# Altium project Augmented_Reality_Sandbox.PrjPcb
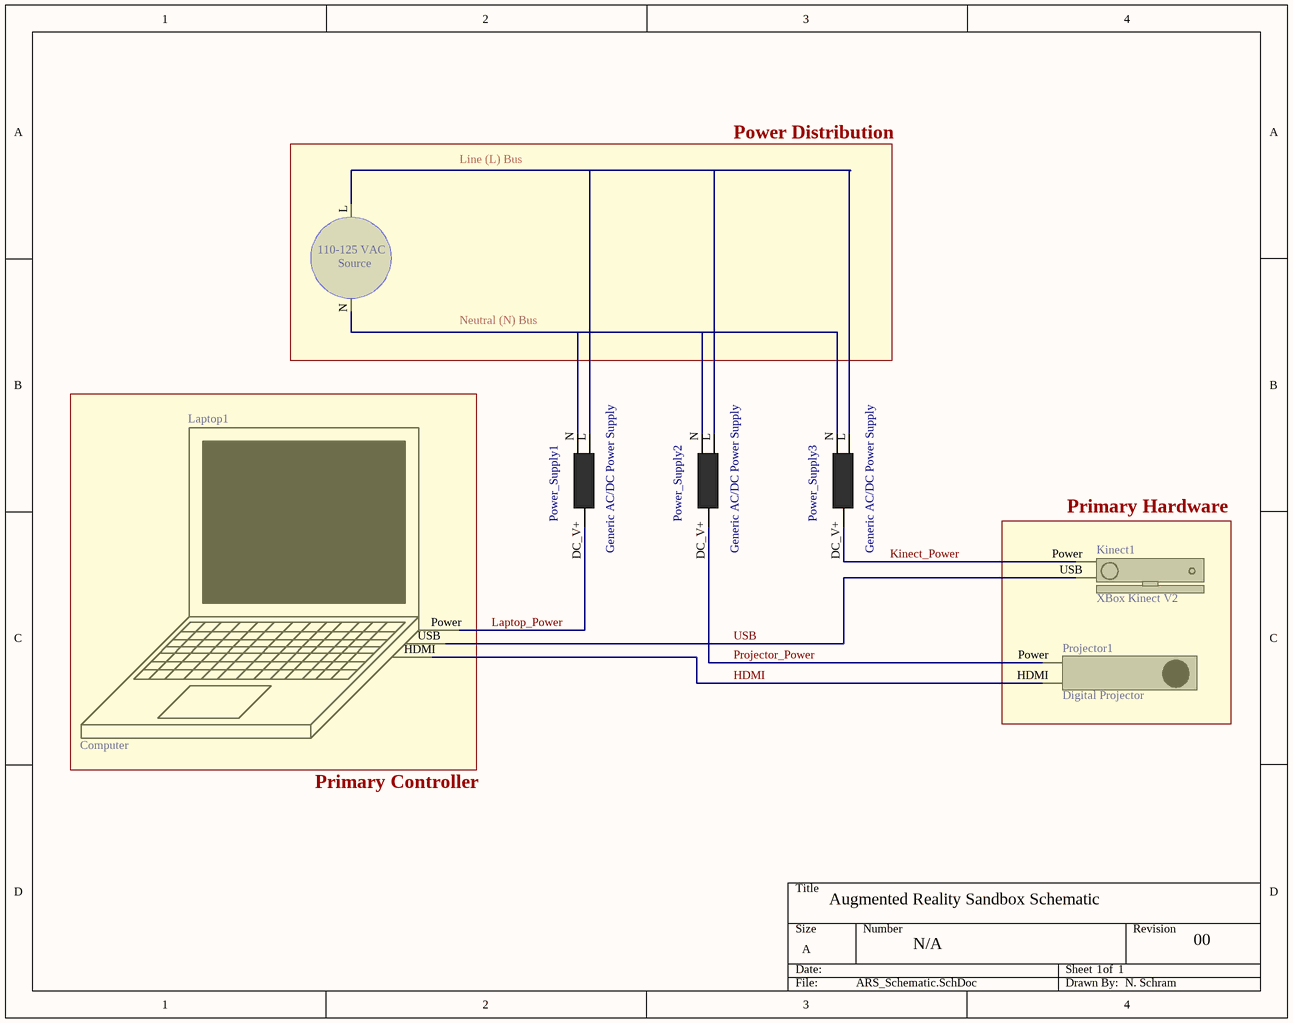
[diagram p0: ARS_Schematic.SchDoc]
1 sheet, 7 parts. Net scope: global (net labels, ports and power ports of the same name join across sheets).

## Sheet ARS_Schematic.SchDoc
size A

### Parts
AC1  110-125 VAC  (value not drawn)
Kinect1  XBox Kinect V2
Laptop1  Computer
Power_Supply1  Generic AC/DC Power Supply
Power_Supply2  Generic AC/DC Power Supply
Power_Supply3  Generic AC/DC Power Supply
Projector1  Digital Projector

### Blocks framed on the sheet
Power Distribution: AC1
Primary Hardware: Kinect1 Projector1

### Nets
HDMI: Laptop1.HDMI Projector1.HDMI
Kinect_Power: Kinect1.Power Power_Supply3.DC_V+
Laptop_Power: Laptop1.Power Power_Supply1.DC_V+
Projector_Power: Power_Supply2.DC_V+ Projector1.Power
USB: Kinect1.USB Laptop1.USB

Not connected (* = marked no-connect by the designer): AC1 L N; Power_Supply1 L N; Power_Supply2 L N; Power_Supply3 L N

### Notes on the sheet
- Primary Controller
- Augmented Reality Sandbox Schematic
- N/A
- 1
- 00
- N. Schram
- Labels drawn without touching a wire or pin: Line (L) Bus, Neutral (N) Bus
- (in symbol AC_Power_Source) Source

### Library data of the parts
AC1 = AC_Power_Source: 110-125 VAC SOURCE
Kinect1 = Xbox_Kinect_V2: Microsoft XBox Kinect V2
Laptop1 = Laptop: Laptop Computer
Power_Supply1-Power_Supply3 = Generic_Power_Supply
Projector1 = Digital_Projector: BenQ Short Throw Digital Projector